# EAGLE design RS485-WeMos (EAGLE 9.6.2)
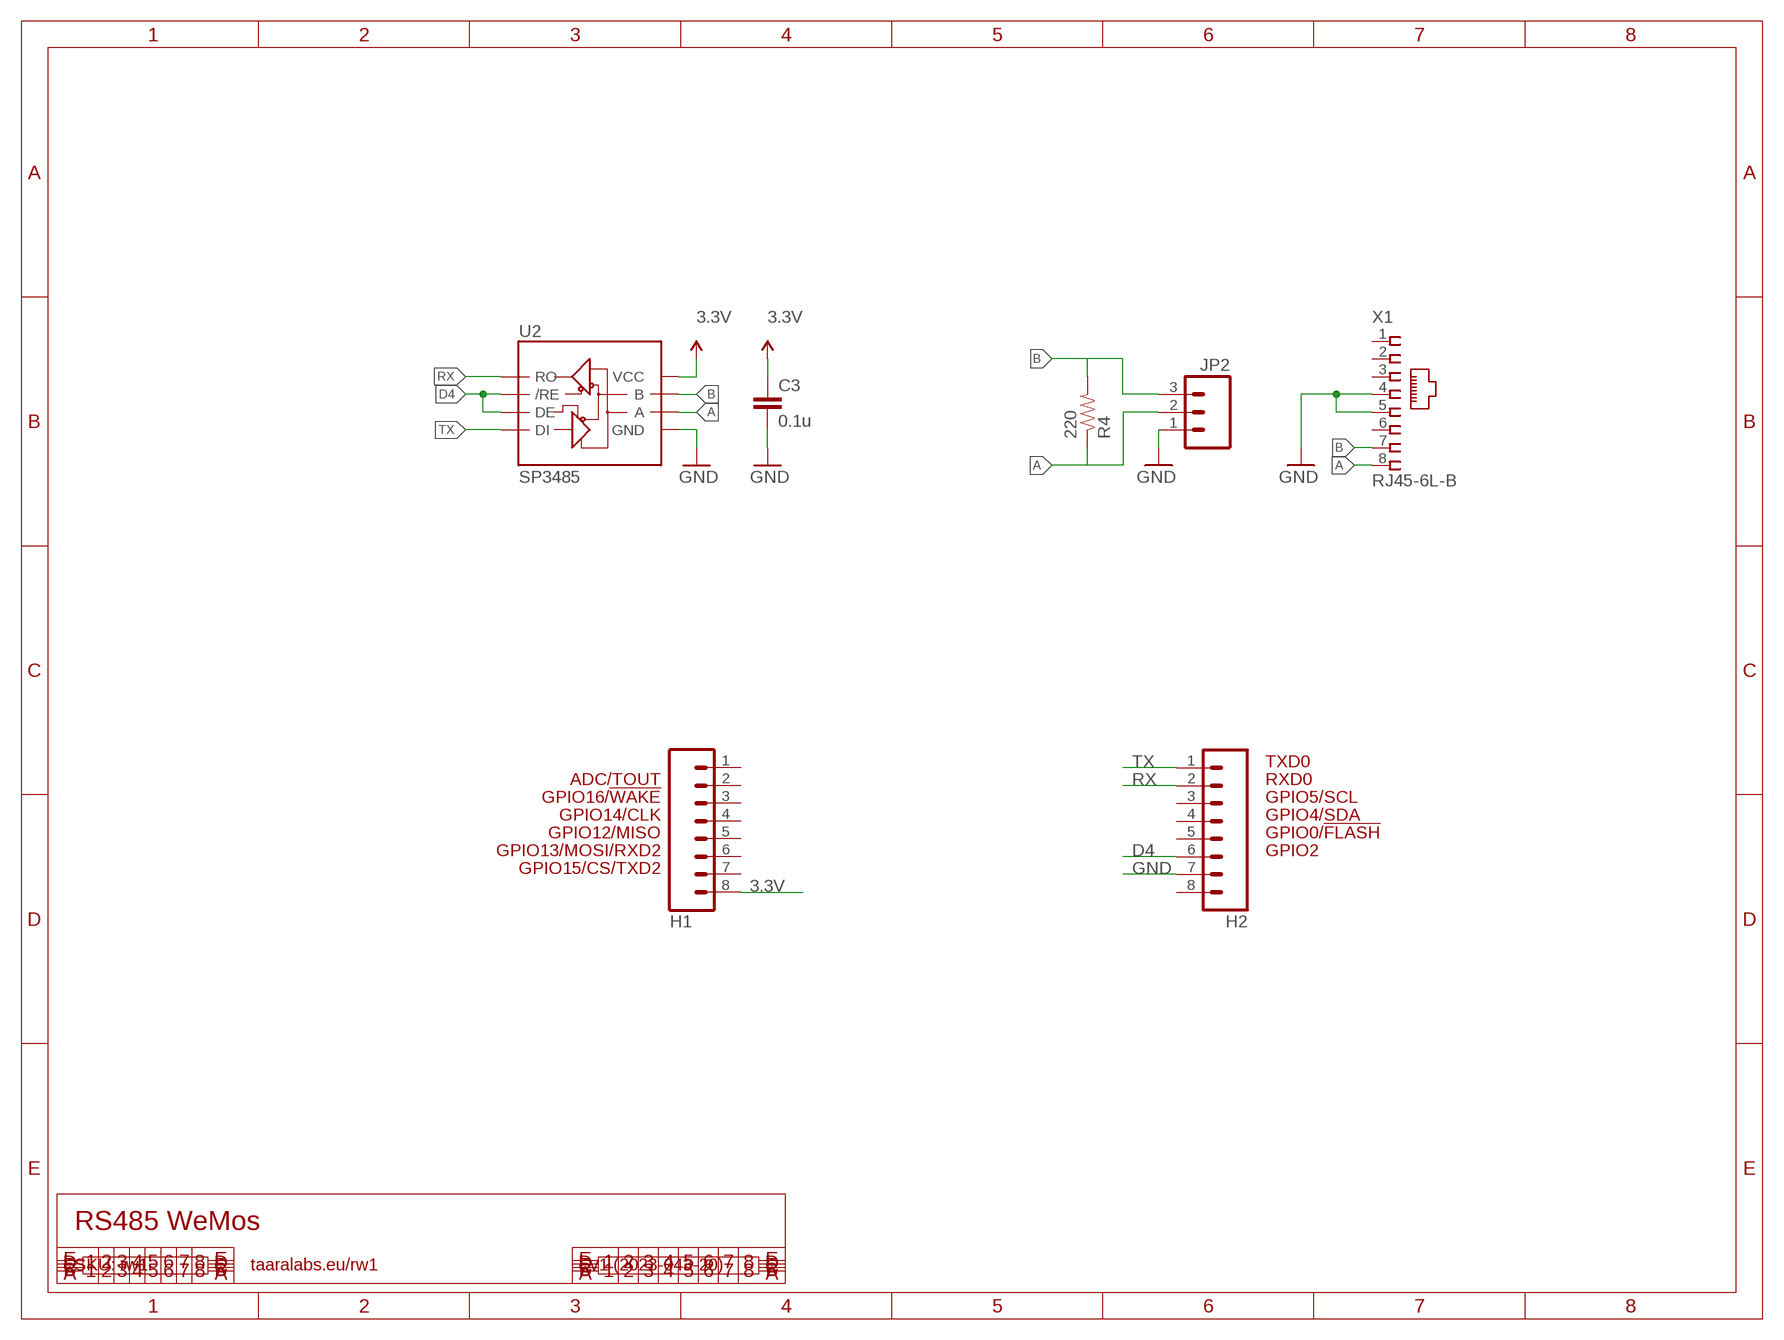
[diagram p0: schematic, sheet 1]

## Parts
C3  0.1u  0.1UF-25V(+80/-20%)(0603)  [0603-CAP]
H1  M08  [1X08]
H2  M08  [1X08]
JP2  M03SCREW  [SCREWTERMINAL-3.5MM-3]
R4  220  22OHM1/10W1%(0603)  [0603-RES]
U2  SP3485  RS485SOIC  [SO08]
X1  RJ45-6L-B  [RJ45-NO-SHIELD]

## Nets
3.3V: C3.1 H1.8 U2.8(VCC) ; supply symbol labelled VCC
A: JP2.2 R4.1 U2.6(A) X1.8
B: JP2.3 R4.2 U2.7(B) X1.7
D4: H2.6 U2.2(/RE) U2.3(DE)
GND: C3.2 H2.7 JP2.1 U2.5(GND) X1.4 X1.5
RX: H2.2 U2.1(RO)
TX: H2.1 U2.4(DI)
Unconnected: H1.1 H1.2 H1.3 H1.4 H1.5 H1.6 H1.7 H2.3 H2.4 H2.5 H2.8 X1.1 X1.2 X1.3 X1.6

## Notes on the sheet
- TXD0
- ADC/TOUT | RXD0
- GPIO16/!WAKE | GPIO5/SCL
- GPIO14/CLK | GPIO4/SDA
- GPIO12/MISO | GPIO0/!FLASH
- GPIO13/MOSI/RXD2 | GPIO2
- GPIO15/CS/TXD2
- RS485 WeMos
- SKU: rw1 | taaralabs.eu/rw1 | v1 (2023-043-20)

## Library data of the parts
C3 = SparkFun-Capacitors:0.1UF-25V(+80/-20%)(0603): CAP-00810 Ceramic Standard decoupling cap; PROD_ID: CAP-00810; VALUE: 0.1uF
H1 H2 = freetronics-original:M08: Header 8 Standard 8-pin 0.1" header. Use with straight break away headers (SKU : PRT-00116), right angle break away headers (PRT-00553), swiss pins (PRT-00743), machine pins (PRT-00117), and female headers (PRT-00115).
JP2 = SparkFun:M03: Header 3 Standard 3-pin 0.1" header. Use with straight break away headers (SKU : PRT-00116), right angle break away headers (PRT-00553), swiss pins (PRT-00743), machine pins (PRT-00117), and female headers (PRT-00115). Molex polarized connector foot print use with SKU : PRT-08232 with associated crimp pins and housings.
R4 = SparkFun-Resistors:22OHM1/10W1%(0603): RES-08698; PROD_ID: RES-08698; VALUE: 22
U2 = SparkFun:RS485
X1 = con-tycoelectronics:RJ45: CORCOM Modular RJ Jacks No Shield Source: www.tycoelectronics.com .. ENG_DS_1654001_1099_RJ_L_0507.pdf; MPN: RJ45-6L-B; OC_FARNELL: unknown; OC_NEWARK: 16R6090

## Net classes
0 default: width 0.203 mm, drill 0.356 mm, clearance 0.152 mm
1 power: width 0.203 mm, clearance 0.152 mm

## Board
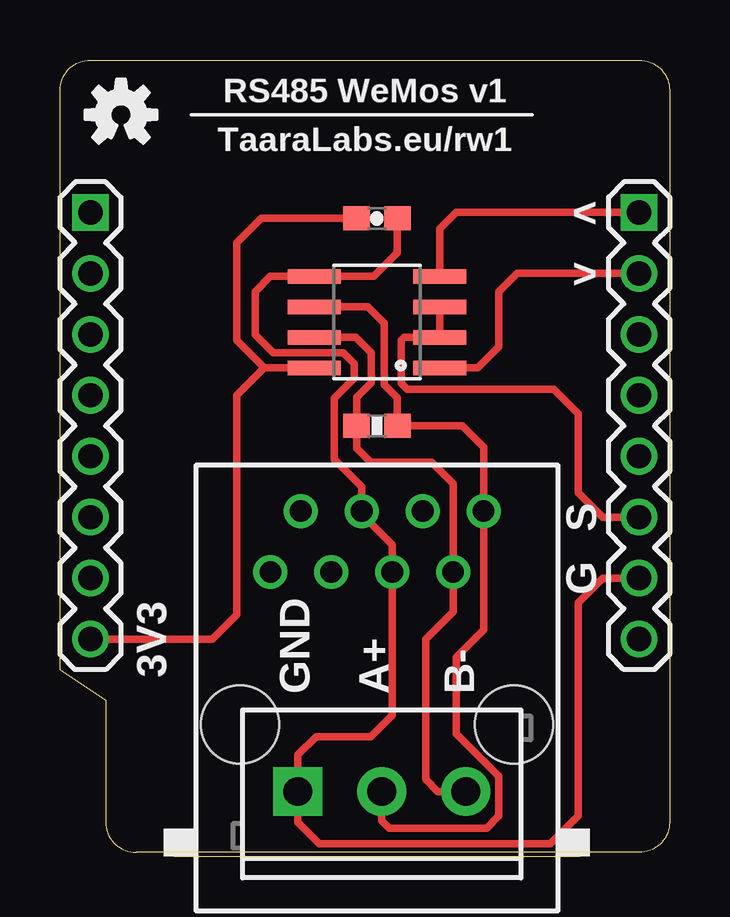
[diagram p1: board, top side]
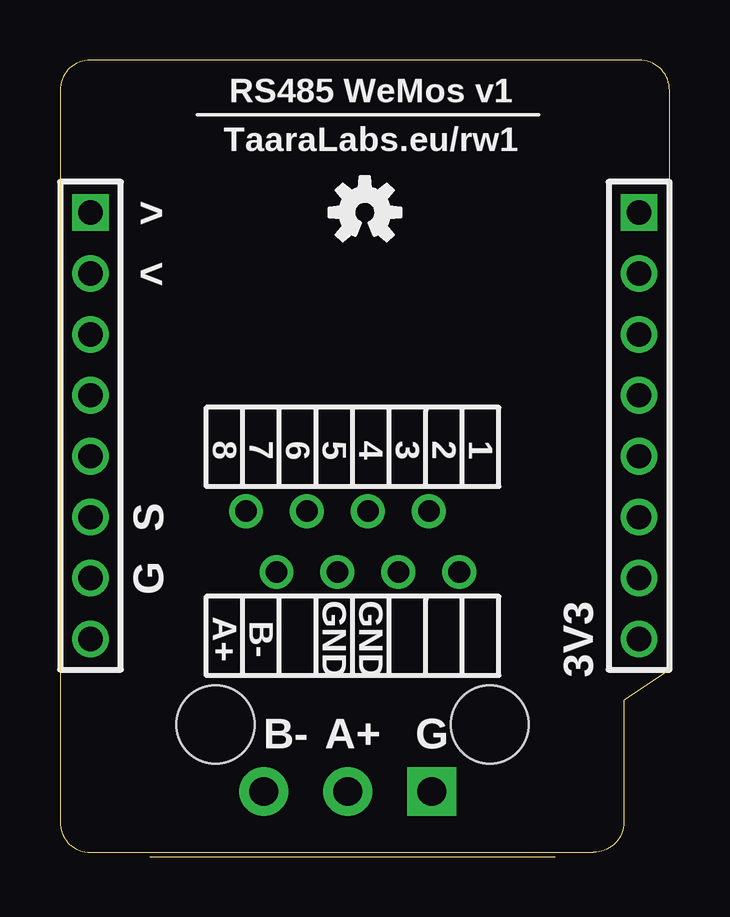
[diagram p2: board, bottom side, seen from below]

Size 25.4 x 33.02 mm. Coordinates in mm from the lower left corner, seen from the top.
Outline: 25.4,31.75 25.4,1.27 arc-90 24.13,0 3.17,0 arc-90 1.91,1.27 1.91,6.35 0,7.62 0,31.75 arc-90 1.27,33.02 24.13,33.02 arc-90 25.4,31.75
Copper layers (1*16): Top 0.035mm / dielectric 1.5mm / Bottom 0.035mm
Design rules "ElectroDragon_2layer_DRU_no_angle_20140221": minimum track width 6mil, minimum drill 12mil, track to track 6mil, track to pad 6mil, pad to pad 6mil, via to via 6mil, smd to smd 6mil, copper to edge 8mil, drill to drill 6mil, minimum pad ring 10mil, minimum via ring 6mil, stop-mask expansion 4mil, vias tented up to drill 100mil, thermal gap 10mil

### Footprints (pad centres in the part's own frame; a part is rotated, then mirrored left to right if it is on the bottom)
0603-CAP = smd 1.1 x 1: 1 -0.85,0; 2 0.85,0
1X08 = drill 1.016 square: 1 0,0 | drill 1.016: 2 2.54,0; 3 5.08,0; 4 7.62,0; 5 10.16,0; 6 12.7,0; 7 15.24,0; 8 17.78,0
SCREWTERMINAL-3.5MM-3 = drill 1.2 pad 2.032 square: 1 0,0 | drill 1.2 pad 2.032: 2 3.5,0; 3 7,0
0603-RES = smd 1.1 x 1: 1 -0.85,0; 2 0.85,0
SO08 = smd 0.61 x 2.21: 1 -1.905,-2.616; 2 -0.635,-2.616; 3 0.635,-2.616; 4 1.905,-2.616; 5 1.905,2.616; 6 0.635,2.616; 7 -0.635,2.616; 8 -1.905,2.616
RJ45-NO-SHIELD = drill 0.9 pad 1.4: 1 -4.445,6.35; 2 -3.175,8.89; 3 -1.905,6.35; 4 -0.635,8.89; 5 0.635,6.35; 6 1.905,8.89; 7 3.175,6.35; 8 4.445,8.89 | hole 3.251: -5.715,0; 5.715,0

### Placement (x,y rotation side)
C3  13.21,26.42 0 top
H1  1.27,26.67 270 top
H2  24.13,26.67 270 top
JP2  9.91,2.54 0 top
R4  13.21,17.78 180 top
U2  13.21,22.1 90 top
U$1  [OSHW-LOGO-S]  2.54,30.73 0 top
U$2  [OSHW-LOGO-S]  12.7,26.67 0 bottom
X1  13.21,5.33 0 top

### Tracks (layer width: path | path; a pad name or v marks a point on that pad's centre or on a via)
3.3V
  Top 0.305: H1.8 6.35,8.89 7.37,9.91 7.37,19.05 8.51,20.19 | C3.1 8.38,26.42 7.37,25.4 7.37,21.34 8.51,20.19 | 8.51,20.19 U2.8
A
  Top 0.305: U2.6 12.83,22.73 13.51,22.05 13.51,19.5 14.06,18.95 R4.1 16.76,17.78 17.65,16.89 X1.8 17.65,9.27 16.51,8.13 16.51,4.95 18.29,3.17 18.29,1.52 17.78,1.02 13.72,1.02 13.41,1.33 JP2.2
B
  Top 0.305: U2.7 12.32,21.46 12.97,20.82 12.97,19.57 12.36,18.96 R4.2 12.36,16.85 12.95,16.26 15.49,16.26 16.38,15.37 X1.7 16.38,10.03 15.24,8.89 15.24,3.05 15.75,2.54 JP2.3
D4
  Top 0.305: U2.3 U2.2 14.35,21.46 14.22,21.34 14.22,19.56 14.48,19.3 20.57,19.3 21.59,18.29 21.59,14.99 22.61,13.97 H2.6
GND
  Top 0.305: C3.2 14.06,24.98 13.08,24 U2.5 8.76,24 8.13,23.37 8.13,21.58 8.88,20.83 11.8,20.83 12.26,20.37 12.26,19.76 11.43,18.94 11.43,16.38 12.57,15.24 X1.4 12.57,14.1 13.84,12.83 X1.5 13.84,5.71 12.95,4.83 10.67,4.83 9.91,4.06 JP2.1 9.91,1.27 10.81,0.37 20.43,0.37 21.59,1.52 21.59,10.41 22.61,11.43 H2.7
RX
  Top 0.305: U2.1 17.4,20.19 18.29,21.08 18.29,23.37 19.05,24.13 H2.2
TX
  Top 0.305: H2.1 16.51,26.67 15.82,25.98 U2.4

### Text on the board
tPlace: RS485 WeMos v1 | TaaraLabs.eu/rw1 | < | > | S | G | 3V3 | GND | A+ | B-
bPlace: RS485 WeMos v1 | TaaraLabs.eu/rw1 | > | < | 1 | 2 | 3 | 4 | 5 | 6 | 7 | 8 | S | G | 3V3 | GND | GND | B- | A+ | G | A+ | B-